# Altium schematic sheet DAP-Power-2.SchDoc
size C; SheetNumber: 2; SheetTotal: 4
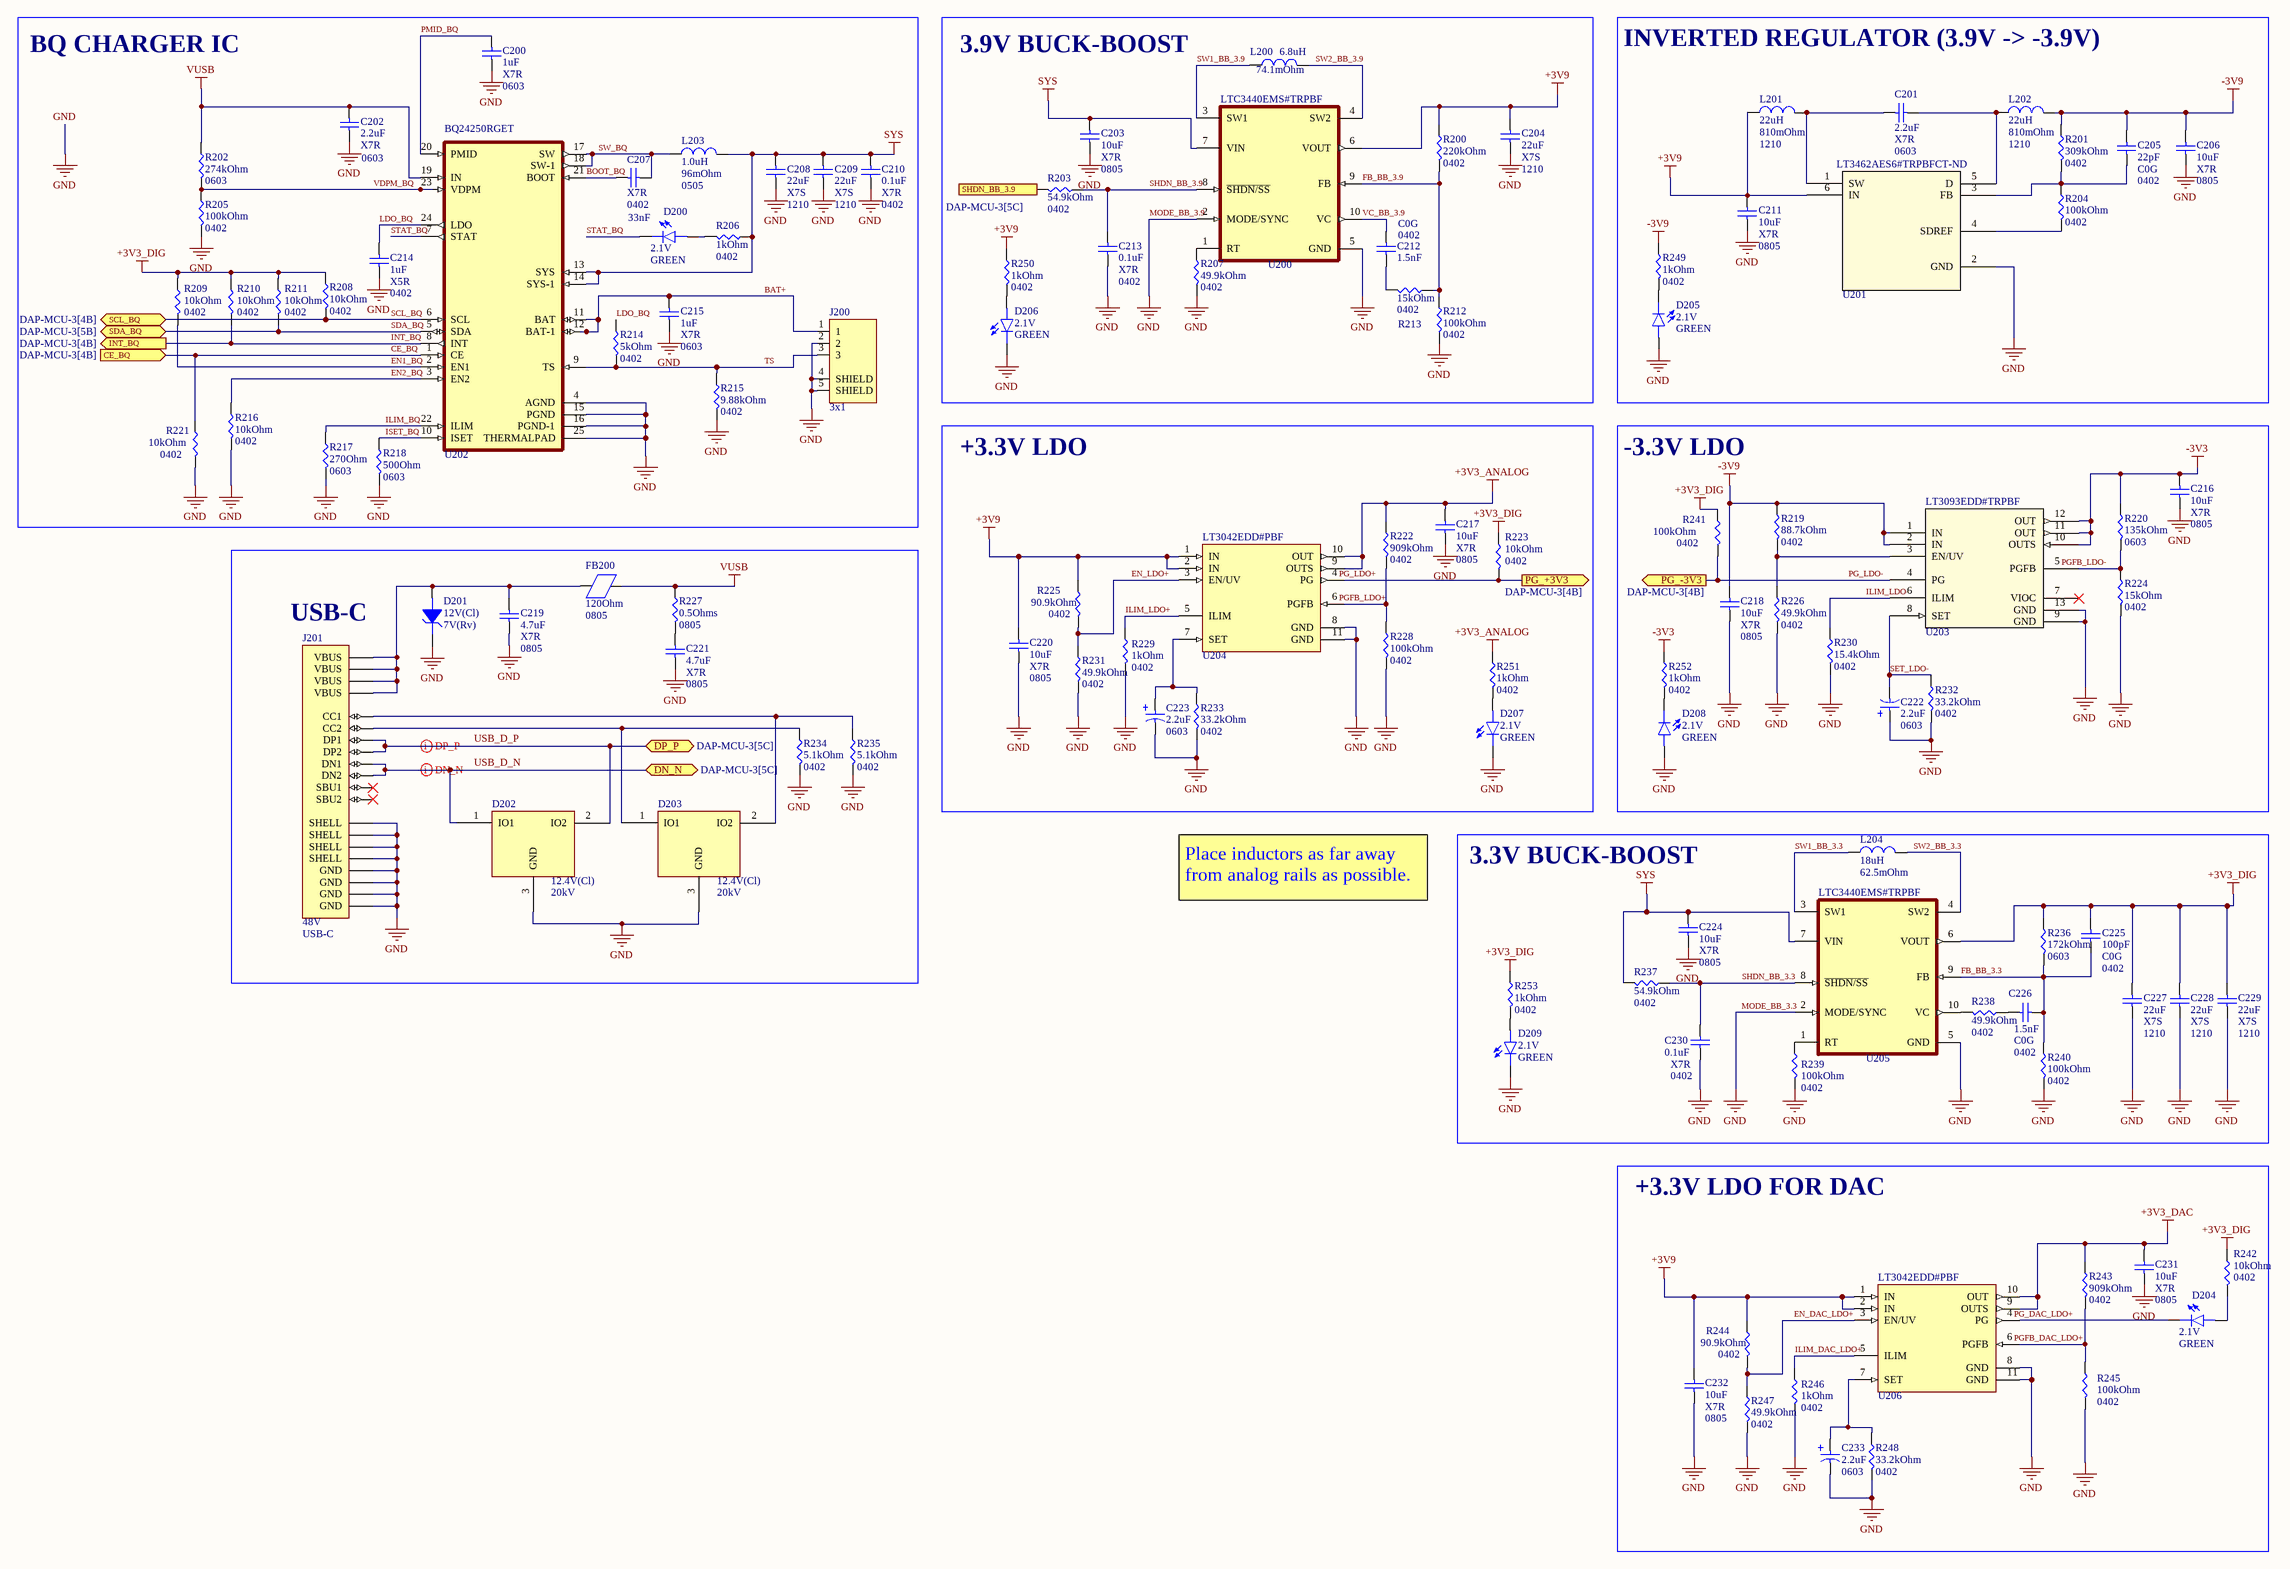
[diagram p0: DAP-Power-2.SchDoc]

## Parts
C200  <Value>: 1uF  <Spec>: X7R  <Footprint>: 0603  [CAPC1608X100N]  (hidden comment: CAP CER 1UF 25V X7R 0603)
C201  <Value>: 2.2uF  <Spec>: X7R  <Footprint>: 0603  [CAPC1608X100N]  (hidden comment: CAP CER 2.2UF 25V X7R 0603)
C202  <Value>: 2.2uF  <Spec>: X7R  <Footprint>: 0603  [CAPC1608X100N]  (hidden comment: CAP CER 2.2UF 25V X7R 0603)
C203  <Value>: 10uF  <Spec>: X7R  <Footprint>: 0805  [CAPC2012X140N]  (hidden comment: CAP CER 10UF 10V X7R 0805)
C204  <Value>: 22uF  <Spec>: X7S  <Footprint>: 1210  [CAPC3225X270N]  (hidden comment: CAP CER 22UF 25V X7S 1210)
C205  <Value>: 22pF  <Spec>: C0G  <Footprint>: 0402  [CAPC1005X60N]  (hidden comment: CAP CER 22PF 50V C0G/NP0 0402)
C206  <Value>: 10uF  <Spec>: X7R  <Footprint>: 0805  [CAPC2012X140N]  (hidden comment: CAP CER 10UF 10V X7R 0805)
C207  <Spec>: X7R  <Footprint>: 0402  <Value>: 33nF  [CAPC1005X60N]  (hidden comment: CAP CER 0.033UF 16V X7R 0402)
C208  <Value>: 22uF  <Spec>: X7S  <Footprint>: 1210  [CAPC3225X270N]  (hidden comment: CAP CER 22UF 25V X7S 1210)
C209  <Value>: 22uF  <Spec>: X7S  <Footprint>: 1210  [CAPC3225X270N]  (hidden comment: CAP CER 22UF 25V X7S 1210)
C210  <Value>: 0.1uF  <Spec>: X7R  <Footprint>: 0402  [CAPC1005X60N]  (hidden comment: CAP CER 0.1UF 50V X7R 0402)
C211  <Value>: 10uF  <Spec>: X7R  <Footprint>: 0805  [CAPC2012X140N]  (hidden comment: CAP CER 10UF 10V X7R 0805)
C212  <Value>: 1.5nF  <Spec>: C0G  <Footprint>: 0402  [CAPC1005X60N]  (hidden comment: CAP CER 1500PF 50V C0G/NP0 0402)
C213  <Value>: 0.1uF  <Spec>: X7R  <Footprint>: 0402  [CAPC1005X60N]  (hidden comment: CAP CER 0.1UF 50V X7R 0402)
C214  <Value>: 1uF  <Spec>: X5R  <Footprint>: 0402  [CAPC1005X60N]  (hidden comment: CAP CER 1UF 35V X5R 0402)
C215  <Value>: 1uF  <Spec>: X7R  <Footprint>: 0603  [CAPC1608X100N]  (hidden comment: CAP CER 1UF 25V X7R 0603)
C216  <Value>: 10uF  <Spec>: X7R  <Footprint>: 0805  [CAPC2012X140N]  (hidden comment: CAP CER 10UF 10V X7R 0805)
C217  <Value>: 10uF  <Spec>: X7R  <Footprint>: 0805  [CAPC2012X140N]  (hidden comment: CAP CER 10UF 10V X7R 0805)
C218  <Value>: 10uF  <Spec>: X7R  <Footprint>: 0805  [CAPC2012X140N]  (hidden comment: CAP CER 10UF 10V X7R 0805)
C219  <Value>: 4.7uF  <Spec>: X7R  <Footprint>: 0805  [CAPC2012X140N]  (hidden comment: CAP CER 4.7UF 16V X7R 0805)
C220  <Value>: 10uF  <Spec>: X7R  <Footprint>: 0805  [CAPC2012X140N]  (hidden comment: CAP CER 10UF 10V X7R 0805)
C221  <Value>: 4.7uF  <Spec>: X7R  <Footprint>: 0805  [CAPC2012X140N]  (hidden comment: CAP CER 4.7UF 16V X7R 0805)
C222  <Value>: 2.2uF  <Footprint>: 0603  [CAP_298D225X0016M2T]  (hidden comment: CAP TANT 2.2UF 20% 16V 0603)
C223  <Value>: 2.2uF  <Footprint>: 0603  [CAP_298D225X0016M2T]  (hidden comment: CAP TANT 2.2UF 20% 16V 0603)
C224  <Value>: 10uF  <Spec>: X7R  <Footprint>: 0805  [CAPC2012X140N]  (hidden comment: CAP CER 10UF 10V X7R 0805)
C225  <Value>: 100pF  <Spec>: C0G  <Footprint>: 0402  [CAPC1005X60N]  (hidden comment: CAP CER 100PF 50V C0G/NP0 0402)
C226  <Value>: 1.5nF  <Spec>: C0G  <Footprint>: 0402  [CAPC1005X60N]  (hidden comment: CAP CER 1500PF 50V C0G/NP0 0402)
C227  <Value>: 22uF  <Spec>: X7S  <Footprint>: 1210  [CAPC3225X270N]  (hidden comment: CAP CER 22UF 25V X7S 1210)
C228  <Value>: 22uF  <Spec>: X7S  <Footprint>: 1210  [CAPC3225X270N]  (hidden comment: CAP CER 22UF 25V X7S 1210)
C229  <Value>: 22uF  <Spec>: X7S  <Footprint>: 1210  [CAPC3225X270N]  (hidden comment: CAP CER 22UF 25V X7S 1210)
C230  <Value>: 0.1uF  <Spec>: X7R  <Footprint>: 0402  [CAPC1005X60N]  (hidden comment: CAP CER 0.1UF 50V X7R 0402)
C231  <Value>: 10uF  <Spec>: X7R  <Footprint>: 0805  [CAPC2012X140N]  (hidden comment: CAP CER 10UF 10V X7R 0805)
C232  <Value>: 10uF  <Spec>: X7R  <Footprint>: 0805  [CAPC2012X140N]  (hidden comment: CAP CER 10UF 10V X7R 0805)
C233  <Value>: 2.2uF  <Footprint>: 0603  [CAP_298D225X0016M2T]  (hidden comment: CAP TANT 2.2UF 20% 16V 0603)
D200  <Value>: 2.1V  <Spec>: GREEN  [LEDM1608X80]  (hidden comment: LED GREEN CLEAR CHIP SMD)
D201  <Value>: 12V(Cl)  <Spec>: 7V(Rv)  [DIOM5226X230N]  (hidden comment: TVS DIODE 7VWM 12VC SMA)
D202  <Value>: 12.4V(Cl)  <Spec>: 20kV  [SOT65P210X110-3N]  (hidden comment: TVS DIODE 5.5VWM 12.4VC SC703)
D203  <Value>: 12.4V(Cl)  <Spec>: 20kV  [SOT65P210X110-3N]  (hidden comment: TVS DIODE 5.5VWM 12.4VC SC703)
D204  <Value>: 2.1V  <Spec>: GREEN  [LEDM1608X80]  (hidden comment: LED GREEN CLEAR CHIP SMD)
D205  <Value>: 2.1V  <Spec>: GREEN  [LEDM1608X80]  (hidden comment: LED GREEN CLEAR CHIP SMD)
D206  <Value>: 2.1V  <Spec>: GREEN  [LEDM1608X80]  (hidden comment: LED GREEN CLEAR CHIP SMD)
D207  <Value>: 2.1V  <Spec>: GREEN  [LEDM1608X80]  (hidden comment: LED GREEN CLEAR CHIP SMD)
D208  <Value>: 2.1V  <Spec>: GREEN  [LEDM1608X80]  (hidden comment: LED GREEN CLEAR CHIP SMD)
D209  <Value>: 2.1V  <Spec>: GREEN  [LEDM1608X80]  (hidden comment: LED GREEN CLEAR CHIP SMD)
FB200  <Value>: 120Ohm  <Footprint>: 0805  [WE-CBF_0805_W4.0]  (hidden comment: FERRITE BEAD 120 OHM 0805 1LN)
J200  <Value>: 3x1  [CONN_505567_03_MOL]  (hidden comment: CONN HEADER SMD R/A 3POS 1.25MM)
J201  <Value>: 48V  <Spec>: USB-C  [GCT_USB4085-GF-A_REVA4]  (hidden comment: CONN RCPT USB2.0 TYPE C 16+8POS)
L200  <Value>: 6.8uH  <Spec>: 74.1mOhm  [IND_SRP4030FA]  (hidden comment: FIXED IND 6.8UH 4A 74.1 MOHM SMD)
L201  <Value>: 22uH  <Spec>: 810mOhm  <Footprint>: 1210  [IND_LQW32FT220M2HL]  (hidden comment: FIXED IND 22UH 300MA 810 MOHM)
L202  <Value>: 22uH  <Spec>: 810mOhm  <Footprint>: 1210  [IND_LQW32FT220M2HL]  (hidden comment: FIXED IND 22UH 300MA 810 MOHM)
L203  <Value>: 1.0uH  <Spec>: 96mOhm  <Footprint>: 0505  [IND_TFM141206BLE]  (hidden comment: FIXED IND 1UH 2A 96 MOHM SMD)
L204  <Value>: 18uH  <Spec>: 62.5mOhm  [IND_XGL5050]  (hidden comment: FIXED IND 18UH 4.5A 62.5 MOHM)
R200  <Value>: 220kOhm  <Footprint>: 0402  [RESC1005X40N]  (hidden comment: RES 220K OHM 0.1% 1/16W 0402)
R201  <Value>: 309kOhm  <Footprint>: 0402  [RESC1005X40N]  (hidden comment: RES SMD 309K OHM 0.1% 1/16W 0402)
R202  <Value>: 274kOhm  <Footprint>: 0603  [0603_Yageo_Res]  (hidden comment: RES SMD 274K OHM 0.5% 1/10W 0603)
R203  <Value>: 54.9kOhm  <Footprint>: 0402  [RESC1005X40N]  (hidden comment: RES SMD 54.9KOHM 0.1% 1/16W 0402)
R204  <Value>: 100kOhm  <Footprint>: 0402  [RESC1005X40N]  (hidden comment: RES SMD 100K OHM 0.1% 1/16W 0402)
R205  <Value>: 100kOhm  <Footprint>: 0402  [RESC1005X40N]  (hidden comment: RES SMD 100K OHM 0.1% 1/16W 0402)
R206  <Value>: 1kOhm  <Footprint>: 0402  [RESC1005X40N]  (hidden comment: RES SMD 1K OHM 0.1% 1/16W 0402)
R207  <Value>: 49.9kOhm  <Footprint>: 0402  [RESC1005X40N]  (hidden comment: RES SMD 49.9KOHM 0.1% 1/16W 0402)
R208  <Value>: 10kOhm  <Footprint>: 0402  [RESC1005X40N]  (hidden comment: RES SMD 10K OHM 1% 1/16W 0402)
R209  <Value>: 10kOhm  <Footprint>: 0402  [RESC1005X40N]  (hidden comment: RES SMD 10K OHM 1% 1/16W 0402)
R210  <Value>: 10kOhm  <Footprint>: 0402  [RESC1005X40N]  (hidden comment: RES SMD 10K OHM 1% 1/16W 0402)
R211  <Value>: 10kOhm  <Footprint>: 0402  [RESC1005X40N]  (hidden comment: RES SMD 10K OHM 1% 1/16W 0402)
R212  <Value>: 100kOhm  <Footprint>: 0402  [RESC1005X40N]  (hidden comment: RES SMD 100K OHM 0.1% 1/16W 0402)
R213  <Value>: 15kOhm  <Footprint>: 0402  [RESC1005X40N]  (hidden comment: RES SMD 15K OHM 0.1% 1/16W 0402)
R214  <Value>: 5kOhm  <Footprint>: 0402  [RESC1005X40N]  (hidden comment: RES 5K OHM 1% 1/16W 0402)
R215  <Value>: 9.88kOhm  <Footprint>: 0402  [RESC1005X40N]  (hidden comment: RES SMD 9.88KOHM 0.5% 1/16W 0402)
R216  <Value>: 10kOhm  <Footprint>: 0402  [RESC1005X40N]  (hidden comment: RES SMD 10K OHM 1% 1/16W 0402)
R217  <Value>: 270Ohm  <Footprint>: 0603  [0603_Yageo_Res]  (hidden comment: RES 270 OHM 1% 1/10W 0603)
R218  <Value>: 500Ohm  <Footprint>: 0603  [0603_Yageo_Res]  (hidden comment: RES 500 OHM 0.1% 1/10W 0603)
R219  <Value>: 88.7kOhm  <Footprint>: 0402  [RESC1005X40N]  (hidden comment: RES 88.7K OHM 1% 1/16W 0402)
R220  <Value>: 135kOhm  <Footprint>: 0603  [RESC1608X55N]  (hidden comment: RES SMD 135K OHM 0.1% 1/10W 0603)
R221  <Value>: 10kOhm  <Footprint>: 0402  [RESC1005X40N]  (hidden comment: RES SMD 10K OHM 1% 1/16W 0402)
R222  <Value>: 909kOhm  <Footprint>: 0402  [RESC1005X40N]  (hidden comment: RES 909K OHM 1% 1/16W 0402)
R223  <Value>: 10kOhm  <Footprint>: 0402  [RESC1005X40N]  (hidden comment: RES SMD 10K OHM 1% 1/16W 0402)
R224  <Value>: 15kOhm  <Footprint>: 0402  [RESC1005X40N]  (hidden comment: RES SMD 15K OHM 0.1% 1/16W 0402)
R225  <Value>: 90.9kOhm  <Footprint>: 0402  [RESC1005X40N]  (hidden comment: RES SMD 90.9KOHM 0.1% 1/16W 0402)
R226  <Value>: 49.9kOhm  <Footprint>: 0402  [RESC1005X40N]  (hidden comment: RES SMD 49.9KOHM 0.1% 1/16W 0402)
R227  <Value>: 0.5Ohms  <Footprint>: 0805  [RES-PYU-PE]  (hidden comment: RES 0.5 OHM 1% 1/4W 0805)
R228  <Value>: 100kOhm  <Footprint>: 0402  [RESC1005X40N]  (hidden comment: RES SMD 100K OHM 0.1% 1/16W 0402)
R229  <Value>: 1kOhm  <Footprint>: 0402  [RESC1005X40N]  (hidden comment: RES SMD 1K OHM 0.1% 1/16W 0402)
R230  <Value>: 15.4kOhm  <Footprint>: 0402  [RESC1005X40N]  (hidden comment: RES SMD 15.4KOHM 0.1% 1/16W 0402)
R231  <Value>: 49.9kOhm  <Footprint>: 0402  [RESC1005X40N]  (hidden comment: RES SMD 49.9KOHM 0.1% 1/16W 0402)
R232  <Value>: 33.2kOhm  <Footprint>: 0402  [RESC1005X40N]  (hidden comment: RES SMD 33.2KOHM 0.1% 1/16W 0402)
R233  <Value>: 33.2kOhm  <Footprint>: 0402  [RESC1005X40N]  (hidden comment: RES SMD 33.2KOHM 0.1% 1/16W 0402)
R234  <Value>: 5.1kOhm  <Footprint>: 0402  [RESC1005X35N]  (hidden comment: RES SMD 5.1K OHM 0.1% 1/16W 0402)
R235  <Value>: 5.1kOhm  <Footprint>: 0402  [RESC1005X35N]  (hidden comment: RES SMD 5.1K OHM 0.1% 1/16W 0402)
R236  <Value>: 172kOhm  <Footprint>: 0603  [RESC1608X55N]  (hidden comment: RES 172K OHM 0.1% 1/10W 0603)
R237  <Value>: 54.9kOhm  <Footprint>: 0402  [RESC1005X40N]  (hidden comment: RES SMD 54.9KOHM 0.1% 1/16W 0402)
R238  <Value>: 49.9kOhm  <Footprint>: 0402  [RESC1005X40N]  (hidden comment: RES SMD 49.9KOHM 0.1% 1/16W 0402)
R239  <Value>: 100kOhm  <Footprint>: 0402  [RESC1005X40N]  (hidden comment: RES SMD 100K OHM 0.1% 1/16W 0402)
R240  <Value>: 100kOhm  <Footprint>: 0402  [RESC1005X40N]  (hidden comment: RES SMD 100K OHM 0.1% 1/16W 0402)
R241  <Value>: 100kOhm  <Footprint>: 0402  [RESC1005X40N]  (hidden comment: RES SMD 100K OHM 0.1% 1/16W 0402)
R242  <Value>: 10kOhm  <Footprint>: 0402  [RESC1005X40N]  (hidden comment: RES SMD 10K OHM 1% 1/16W 0402)
R243  <Value>: 909kOhm  <Footprint>: 0402  [RESC1005X40N]  (hidden comment: RES 909K OHM 1% 1/16W 0402)
R244  <Value>: 90.9kOhm  <Footprint>: 0402  [RESC1005X40N]  (hidden comment: RES SMD 90.9KOHM 0.1% 1/16W 0402)
R245  <Value>: 100kOhm  <Footprint>: 0402  [RESC1005X40N]  (hidden comment: RES SMD 100K OHM 0.1% 1/16W 0402)
R246  <Value>: 1kOhm  <Footprint>: 0402  [RESC1005X40N]  (hidden comment: RES SMD 1K OHM 0.1% 1/16W 0402)
R247  <Value>: 49.9kOhm  <Footprint>: 0402  [RESC1005X40N]  (hidden comment: RES SMD 49.9KOHM 0.1% 1/16W 0402)
R248  <Value>: 33.2kOhm  <Footprint>: 0402  [RESC1005X40N]  (hidden comment: RES SMD 33.2KOHM 0.1% 1/16W 0402)
R249  <Value>: 1kOhm  <Footprint>: 0402  [RESC1005X40N]  (hidden comment: RES SMD 1K OHM 0.1% 1/16W 0402)
R250  <Value>: 1kOhm  <Footprint>: 0402  [RESC1005X40N]  (hidden comment: RES SMD 1K OHM 0.1% 1/16W 0402)
R251  <Value>: 1kOhm  <Footprint>: 0402  [RESC1005X40N]  (hidden comment: RES SMD 1K OHM 0.1% 1/16W 0402)
R252  <Value>: 1kOhm  <Footprint>: 0402  [RESC1005X40N]  (hidden comment: RES SMD 1K OHM 0.1% 1/16W 0402)
R253  <Value>: 1kOhm  <Footprint>: 0402  [RESC1005X40N]  (hidden comment: RES SMD 1K OHM 0.1% 1/16W 0402)
U200  IC REG BUCK BST ADJ 600MA 10MSOP  [SOP50P490X110-10N]  (value not drawn)
U201  Supplier Part Number 1: LT3462AES6#TRPBFCT-ND  [TSOT-23_S6]  (hidden comment: IC REG CUK ADJ 250MA TSOT23-6)
U202  IC BATT CHG LI-ION 1CELL 24VQFN  [QFN50P400X400X100-25N]  (value not drawn)
U203  Manufacturer Part Number 1: LT3093EDD#TRPBF  [05-08-1725_ADI]  (hidden comment: IC REG LIN NEG ADJ 200MA 12-DFN)
U204  IC REG LIN POS ADJ 200MA 10DFN  [VREG_LT3042EDD#PBF]  (value not drawn)
U205  IC REG BUCK BST ADJ 600MA 10MSOP  [SOP50P490X110-10N]  (value not drawn)
U206  IC REG LIN POS ADJ 200MA 10DFN  [VREG_LT3042EDD#PBF]  (value not drawn)

## Blocks framed on the sheet
BQ CHARGER IC: C200 C202 C207-C210 C214 C215 D200 J200 L203 R202 R205 R206 R208-R211 R214-R218 R221 U202
3.9V BUCK-BOOST: C203 C204 C212 C213 D206 L200 R200 R203 R207 R212 R213 R250 U200
INVERTED REGULATOR (3.9V -> -3.9V): C201 C205 C206 C211 D205 L201 L202 R201 R204 R249 U201
+3.3V LDO: C217 C220 C223 D207 R222 R223 R225 R228 R229 R231 R233 R251 U204
-3.3V LDO: C216 C218 C222 D208 R219 R220 R224 R226 R230 R232 R241 R252 U203
USB-C: C219 C221 D201-D203 FB200 J201 R227 R234 R235
3.3V BUCK-BOOST: C224-C230 D209 L204 R236-R240 R253 U205
+3.3V LDO FOR DAC: C231-C233 D204 R242-R248 U206

## Ports
CE_BQ (in, see DAP-MCU-3[4B]), DN_N (bidir, see DAP-MCU-3[5C]), DP_P (bidir, see DAP-MCU-3[5C]), INT_BQ (out, see DAP-MCU-3[4B]), PG_+3V3 (out, see DAP-MCU-3[4B]), PG_-3V3 (out, see DAP-MCU-3[4B]), SCL_BQ (bidir, see DAP-MCU-3[4B]), SDA_BQ (bidir, see DAP-MCU-3[5B]), SHDN_BB_3.9 (in, see DAP-MCU-3[5C])

## Nets
+3V3_ANALOG: C217.2 R222.2 R251.2 U204.9(OUTS) U204.10(OUT)
+3V3_DAC: C231.2 R243.2 U206.9(OUTS) U206.10(OUT)
+3V3_DIG: C225.2 C227.2 C228.2 C229.2 R208.2 R209.2 R210.2 R211.2 R223.2 R236.2 R241.2 R242.2 R253.2 U205.6(VOUT)
+3V9: C204.2 C211.2 C220.2 C232.2 L201.1 R200.2 R225.2 R244.2 R250.2 U200.6(VOUT) U201.6(IN) U204.1(IN) U204.2(IN) U206.1(IN) U206.2(IN)
-3V3: C216.2 R220.2 R252.2 U203.10(OUTS) U203.11(OUT) U203.12(OUT)
-3V9: C205.2 C206.2 C218.2 L202.2 R201.2 R219.2 R249.2 U203.1(IN) U203.2(IN)
GND: C200.1 C202.1 C203.1 C204.1 C206.1 C208.1 C209.1 C210.1 C211.1 C213.1 C214.1 C215.1 C216.1 C217.1 C218.1 C219.1 C220.1 C221.1 C222.1 C223.2 C224.1 C227.1 C228.1 C229.1 C230.1 C231.1 C232.1 C233.2 D201.C D202.3(GND) D203.3(GND) D205.A D206.C D207.C D208.A D209.C J200.2 J200.4(SHIELD) J200.5(SHIELD) J201.A1(GND) J201.A12(GND) J201.B1(GND) J201.B12(GND) J201.S1(SHELL) J201.S2(SHELL) J201.S3(SHELL) J201.S4(SHELL) R205.1 R207.1 R212.1 R215.1 R216.1 R217.1 R218.1 R221.1 R224.1 R226.1 R228.1 R229.1 R230.1 R231.1 R232.1 R233.1 R234.1 R235.1 R239.1 R240.1 R245.1 R246.1 R247.1 R248.1 U200.2(MODE/SYNC) U200.5(GND) U201.2(GND) U202.4(AGND) U202.15(PGND) U202.16(PGND-1) U202.25(THERMALPAD) U203.9(GND) U203.13(GND) U204.8(GND) U204.11(GND) U205.2(MODE/SYNC) U205.5(GND) U206.8(GND) U206.11(GND)  [also labelled MODE_BB_3.3, MODE_BB_3.9]
SYS: C203.2 C208.2 C209.2 C210.2 C224.2 L203.2 R206.2 R237.1 U200.7(VIN) U202.13(SYS) U202.14(SYS-1) U205.7(VIN)
VUSB: C202.2 FB200.2 R202.2 R227.2 U202.19(IN)
BAT+: C215.2 J200.1 U202.11(BAT) U202.12(BAT-1)
BOOT_BQ: C207.2 U202.21(BOOT)
CE_BQ: R221.2 U202.1(CE) ; port CE_BQ
EN1_BQ: R209.1 U202.2(EN1)
EN2_BQ: R216.2 U202.3(EN2)
EN_DAC_LDO+: R244.1 R247.2 U206.3(EN/UV)
EN_LDO+: R225.1 R231.2 U204.3(EN/UV)
FB_BB_3.3: C225.1 C226.1 R236.1 R240.2 U205.9(FB)
FB_BB_3.9: R200.1 R212.2 R213.2 U200.9(FB)
ILIM_BQ: R217.2 U202.22(ILIM)
ILIM_DAC_LDO+: R246.2 U206.5(ILIM)
ILIM_LDO+: R229.2 U204.5(ILIM)
ILIM_LDO-: R230.2 U203.6(ILIM)
INT_BQ: R210.1 U202.8(INT) ; port INT_BQ
ISET_BQ: R218.2 U202.10(ISET)
LDO_BQ: C214.2 R214.2 U202.24(LDO)
PG_+3V3: R223.1 U204.4(PG) ; port PG_+3V3
PG_LDO-: R241.1 U203.4(PG) ; port PG_-3V3
PMID_BQ: C200.2 U202.20(PMID)
SCL_BQ: R208.1 U202.6(SCL) ; port SCL_BQ
SDA_BQ: R211.1 U202.5(SDA) ; port SDA_BQ
SET_LDO-: C222.2 R232.2 U203.8(SET)
SHDN_BB_3.3: C230.2 R237.2 U205.8(~{SHDN/SS})
SHDN_BB_3.9: C213.2 R203.2 U200.8(~{SHDN/SS})
SHDN_BB_3.9: R203.1 ; port SHDN_BB_3.9  [a separate net that carries the same name]
STAT_BQ: D200.C U202.7(STAT)
SW1_BB_3.3: L204.1 U205.3(SW1)
SW1_BB_3.9: L200.1 U200.3(SW1)
SW2_BB_3.3: L204.2 U205.4(SW2)
SW2_BB_3.9: L200.2 U200.4(SW2)
SW_BQ: C207.1 L203.1 U202.17(SW) U202.18(SW-1)
TS: J200.3 R214.1 R215.2 U202.9(TS)
USB_D_N: D202.1(IO1) J201.A7(DN1) J201.B7(DN2) ; port DN_N
USB_D_P: D202.2(IO2) J201.A6(DP1) J201.B6(DP2) ; port DP_P
VC_BB_3.9: C212.2 U200.10(VC)
VDPM_BQ: R202.1 R205.2 U202.23(VDPM)
NetC201_1: C201.1 L202.1 U201.5(D)
NetC201_2: C201.2 L201.2 U201.1(SW)
NetC205_1: C205.1 R201.1 R204.2 U201.3(FB)
NetC212_1: C212.1 R213.1
NetC219_2: C219.2 D201.A FB200.1 J201.A4(VBUS) J201.A9(VBUS) J201.B4(VBUS) J201.B9(VBUS)
NetC221_2: C221.2 R227.1
NetC223_1: C223.1 R233.2 U204.7(SET)
NetC226_2: C226.2 R238.2
NetC233_1: C233.1 R248.2 U206.7(SET)
NetD200_A: D200.A R206.1
NetD203_1: D203.1(IO1) J201.B5(CC2) R234.2
NetD203_2: D203.2(IO2) J201.A5(CC1) R235.2
NetD204_A: D204.A R242.1
NetD204_C: D204.C U206.4(PG)
NetD205_C: D205.C R249.1
NetD206_A: D206.A R250.1
NetD207_A: D207.A R251.1
NetD208_C: D208.C R252.1
NetD209_A: D209.A R253.1
NetR204_1: R204.1 U201.4(SDREF)
NetR207_2: R207.2 U200.1(RT)
NetR219_1: R219.1 R226.2 U203.3(EN/UV)
NetR220_1: R220.1 R224.2 U203.5(PGFB)
NetR222_1: R222.1 R228.2 U204.6(PGFB)
NetR238_1: R238.1 U205.10(VC)
NetR239_2: R239.2 U205.1(RT)
NetR243_1: R243.1 R245.2 U206.6(PGFB)

Not connected (* = marked no-connect by the designer): J201 A8(SBU1)* B8(SBU2)*; U203 7(VIOC)*

## Layout directives
differential pair: USB_D_N, USB_D_P

## Notes on the sheet
- Place inductors as far away from analog rails as possible.
- Labels drawn without touching a wire or pin: PG_DAC_LDO+, PG_LDO+, PGFB_DAC_LDO+, PGFB_LDO+, PGFB_LDO-

## Library data of the parts
C200 C215 = #1-132: Manufacturer 1: Murata Electronics; Manufacturer Part Number 1: GCM188R71E105KA64D; AL-PN: #1-132; SubType: Ceramic; <Tolerance>: 0.1; <Termination>: SMD; Creator Project: DAP; Type: Standard; Lead Time: 21 Weeks; PartType: Capacitor; <Rating>: 25V; Status: Verified; Supplier 1: Digikey; Supplier Label: 1 µF ±10% 25V Ceramic Capacitor X7R 0603 (1608 Metric); Supplier Part Number 1: 490-10673-1-ND
C201 C202 = #1-070: Manufacturer 1: Murata Electronics; Manufacturer Part Number 1: GRM188Z71E225KE43D; AL-PN: #1-070; SubType: Ceramic; <Tolerance>: 0.1; <Termination>: SMD; Creator Project: DAP; Type: Standard; Lead Time: 17 Weeks; PartType: Capacitor; <Rating>: 25V; Status: Verified; Supplier 1: Digikey; Supplier Label: 2.2 µF ±10% 25V Ceramic Capacitor X7R 0603 (1608 Metric); Supplier Part Number 1: 490-GRM188Z71E225KE43DCT-ND
C203 C206 C211 C216-C218 C220 C224 C231 C232 = #1-081: Manufacturer 1: Murata Electronics; Manufacturer Part Number 1: GCM21BR71A106KE22K; AL-PN: #1-081; SubType: Ceramic; <Tolerance>: 0.1; <Termination>: SMD; Creator Project: DAP; Type: Standard; Lead Time: 21 Weeks; PartType: Capacitor; <Rating>: 10V; Status: Verified; Supplier 1: Digikey; Supplier Label: 10 µF ±10% 10V Ceramic Capacitor X7R 0805 (2012 Metric); Supplier Part Number 1: 490-14531-1-ND
C204 C208 C209 C227-C229 = #1-073: Manufacturer 1: Murata Electronics; Manufacturer Part Number 1: GCM32EC71E226KE36L; AL-PN: #1-073; SubType: Ceramic; <Tolerance>: 0.1; <Termination>: SMD; Creator Project: DAP; Type: Standard; Lead Time: 21 Weeks; PartType: Capacitor; <Rating>: 25V; Status: Verified; Supplier 1: Digikey; Supplier Label: 22 µF ±10% 25V Ceramic Capacitor X7S 1210 (3225 Metric); Supplier Part Number 1: 490-GCM32EC71E226KE36LCT-ND
C205 = #1-093: Manufacturer 1: Murata Electronics; Manufacturer Part Number 1: GRM1555C1H220JA01D; AL-PN: #1-093; SubType: Ceramic; <Tolerance>: 0.05; <Termination>: SMD; Creator Project: DAP; Type: Standard; Lead Time: 17 Weeks; PartType: Capacitor; <Rating>: 50V; Status: Verified; Supplier 1: Digikey; Supplier Label: 22 pF ±5% 50V Ceramic Capacitor C0G, NP0 0402 (1005 Metric); Supplier Part Number 1: 490-5868-1-ND
C207 = #1-059: Manufacturer 1: Murata Electronics; Manufacturer Part Number 1: GRM155R71C333KA01D; AL-PN: #1-059; SubType: Ceramic; <Tolerance>: 0.1; <Termination>: SMD; Creator Project: DAP; Type: Standard; Lead Time: 17 Weeks; PartType: Capacitor; <Rating>: 16V; Status: Verified; Supplier 1: Digikey; Supplier Label: 0.033 µF ±10% 16V Ceramic Capacitor X7R 0402 (1005 Metric); Supplier Part Number 1: 490-3257-1-ND
C210 = #1-048: Manufacturer 1: Murata Electronics; Manufacturer Part Number 1: GRM155R71H104KE14D; AL-PN: #1-048; SubType: Ceramic; <Tolerance>: 0.1; <Termination>: SMD; Creator Project: aRTy; Type: Standard; Lead Time: 17 Weeks; PartType: Capacitor; <Rating>: 50V; Status: Verified; Supplier 1: Digikey; Supplier Label: 0.1 µF ±10% 50V Ceramic Capacitor X7R 0402 (1005 Metric); Supplier Part Number 1: 490-10700-1-ND
C212 C226 = #1-077: Manufacturer 1: Murata Electronics; Manufacturer Part Number 1: GRM1555C1H152GA01D; AL-PN: #1-077; SubType: Ceramic; <Tolerance>: 0.02; <Termination>: SMD; Creator Project: DAP; Type: Standard; Lead Time: 17 Weeks; PartType: Capacitor; <Rating>: 50V; Status: Verified; Supplier 1: Digikey; Supplier Label: 1500 pF ±2% 50V Ceramic Capacitor C0G, NP0 0402 (1005 Metric); Supplier Part Number 1: 490-GRM1555C1H152GA01DCT-ND
C213 C230 = #1-080: Manufacturer 1: Murata Electronics; Manufacturer Part Number 1: GCM155R71H104KE02D; AL-PN: #1-080; SubType: Ceramic; <Tolerance>: 0.1; <Termination>: SMD; Creator Project: DAP; Type: Standard; Lead Time: 21 Weeks; PartType: Capacitor; <Rating>: 50V; Status: Verified; Supplier 1: Digikey; Supplier Label: 0.1 µF ±10% 50V Ceramic Capacitor X7R 0402 (1005 Metric); Supplier Part Number 1: 490-10672-1-ND
C214 = #1-092: Manufacturer 1: Murata Electronics; Manufacturer Part Number 1: GRM155R6YA105KE11D; AL-PN: #1-092; SubType: Ceramic; <Tolerance>: 0.1; <Termination>: SMD; Creator Project: DAP; Type: Standard; Lead Time: 17 Weeks; PartType: Capacitor; <Rating>: 35V; Status: Verified; Supplier 1: Digikey; Supplier Label: 1 µF ±10% 35V Ceramic Capacitor X5R 0402 (1005 Metric); Supplier Part Number 1: 490-10019-1-ND
C219 C221 = #1-071: Manufacturer 1: Murata Electronics; Manufacturer Part Number 1: GRM21BR71C475KE51L; AL-PN: #1-071; SubType: Ceramic; <Tolerance>: 0.1; <Termination>: SMD; Creator Project: DAP; Type: Standard; Lead Time: 17 Weeks; PartType: Capacitor; <Rating>: 16V; Status: Verified; Supplier 1: Digikey; Supplier Label: 4.7 µF ±10% 16V Ceramic Capacitor X7R 0805 (2012 Metric); Supplier Part Number 1: 490-14466-1-ND
C222 C223 C233 = #1-098: Manufacturer 1: Vishay Sprague; Manufacturer Part Number 1: 298D225X0016M2T; AL-PN: #1-098; SubType: Tantalum; <Tolerance>: 0.2; <Termination>: SMD; Creator Project: DAP; Type: Standard; Lead Time: 23 Weeks; PartType: Capacitor; <Rating>: 16V; Status: Verified; Supplier 1: Digikey; Supplier Label: 2.2 µF Molded Tantalum Capacitors 16 V 0603 (1608 Metric) 12Ohm; Supplier Part Number 1: 718-1613-1-ND
C225 = #1-096: Manufacturer 1: Murata Electronics; Manufacturer Part Number 1: GRM1555C1H101JA01D; AL-PN: #1-096; SubType: Ceramic; <Tolerance>: 0.05; <Termination>: SMD; Creator Project: DAP; Type: Standard; Lead Time: 17 Weeks; PartType: Capacitor; <Rating>: 50V; Status: Verified; Supplier 1: Digikey; Supplier Label: 100 pF ±5% 50V Ceramic Capacitor C0G, NP0 0402 (1005 Metric); Supplier Part Number 1: 490-5922-1-ND
D200 D204-D209 = #1-009: Manufacturer 1: Lite-On Inc; Manufacturer Part Number 1: LTST-C190GKT; AL-PN: #1-009; <Rating>: 30mA; Creator Project: Bootcamp; Type: Standard; Lead Time: 14 Weeks; PartType: Diode; SubType: LED; <Termination>: SMD; Status: Verified; Supplier 1: Digikey; Supplier Label: Green 569nm LED Indication - Discrete 2.1V 0603 (1608 Metric); Supplier Part Number 1: 160-LTST-C190GKTTR-ND
D201 = #1-049: Manufacturer 1: Diodes Incorporated; Manufacturer Part Number 1: SMAJ7.0A-13-F; AL-PN: #1-049; <Rating>: 7.78V(Bd); <Termination>: SMD; Creator Project: aRTy; Type: Standard; Lead Time: 12 Weeks; PartType: Diode; SubType: TVS; Status: Verified; Supplier 1: Digikey; Supplier Label: 12V Clamp 33.3A Ipp Tvs Diode Surface Mount SMA; Supplier Part Number 1: SMAJ7.0A-FDICT-ND
D202 D203 = #1-099: Manufacturer 1: Texas Instruments; Manufacturer Part Number 1: TPD2E2U06QDCKRQ1; AL-PN: #1-099; <Rating>: 1.5pF; <Termination>: SMD; Creator Project: DAP; Type: Standard; Lead Time: 9 Weeks; PartType: Diode; SubType: TVS; Status: Verified; Supplier 1: Digikey; Supplier Label: 12.4V (Typ) Clamp 5.5A (8/20µs) Ipp Tvs Diode Surface Mount SC-70-3; Supplier Part Number 1: 296-44302-1-ND
FB200 = #1-068: Manufacturer 1: Würth Elektronik; Manufacturer Part Number 1: 742792023; AL-PN: #1-068; <Rating>: 3A; <Termination>: SMD; Creator Project: DAP; Type: Standard; Lead Time: 33 Weeks; PartType: Misc; SubType: Ferrite Bead; Status: Verified; Supplier 1: Digikey; Supplier Label: 120 Ohms @ 100 MHz 1 Signal Line Ferrite Bead 0805 (2012 Metric) 3A 30mOhm; Supplier Part Number 1: 732-1613-1-ND
J200 = #1-137: Manufacturer 1: Molex; Manufacturer Part Number 1: 5055670381; MF: {'manufacturer': u'Molex'}; MP: 436500329; AL-PN: #1-137; Creator Project: DAP; Lead Time: 19 Weeks; Package: None; Price: None; Value: *; Availability: Unavailable; PartType: Connector; SubType: Header; <Termination>: SMD; Status: Verified; Supplier 1: Digikey; Supplier Label: Connector Header Surface Mount, Right Angle 3 position 0.049" (1.25mm); Supplier Part Number 1: WM22227CT-ND; Type: Standard
J201 = #1-069: Manufacturer 1: GCT; MP: USB4085-GF-A; MF: Global Connector Technology; AL-PN: #1-069; SubType: USB; <Rating>: 5A; <Termination>: Thru; Creator Project: DAP; Lead Time: 7 Weeks; SnapEDA_Link: https://www.snapeda.com/parts/USB4085-GF-A/Global+Connector+Technology/view-part/?ref=snap; Package: None; Check_prices: https://www.snapeda.com/parts/USB4085-GF-A/Global+Connector+Technology/view-part/?ref=eda; Purchase-URL: https://pricing.snapeda.com/search/part/USB4085-GF-A/?ref=eda; Price: None; Value: *; Availability: In Stock; PartType: Connector; Status: Verified; Supplier 1: Digikey; Supplier Label: USB-C (USB TYPE-C) USB 2.0 Receptacle Connector 24 (16+8 Dummy) Position Through Hole, Right Angle; Supplier Part Number 1: 2073-USB4085-GF-ACT-ND; Type: Standard; Manufacturer Part Number 1: USB4085-GF-A
L200 = #1-076: Manufacturer 1: Bourns Inc.; Manufacturer Part Number 1: SRP4030FA-6R8M; AL-PN: #1-076; SubType: Shielded; <Rating>: 3.5A; <Tolerance>: 0.2; Creator Project: DAP; Type: Standard; Lead Time: 22 Weeks; PartType: Inductor; <Termination>: SMD; Status: Verified; Supplier 1: Digikey; Supplier Label: 6.8 µH Shielded Drum Core, Wirewound Inductor 4 A 74.1mOhm Max Nonstandard; Supplier Part Number 1: SRP4030FA-6R8MCT-ND
L201 L202 = #1-090: Manufacturer 1: Murata Electronics; Manufacturer Part Number 1: 490-LQW32FT220M2HLTR; AL-PN: #1-090; SubType: Shielded; <Rating>: 400mA; <Tolerance>: 0.2; <Termination>: SMD; Creator Project: DAP; Type: Standard; Lead Time: 25 Weeks; PartType: Inductor; Status: Verified; Supplier 1: Digikey; Supplier Label: 22 µH Shielded Wirewound Inductor 300 mA 810mOhm Max 1210 (3225 Metric); Supplier Part Number 1: 490-LQW32FT220M2HLCT-ND
L203 = #1-063: Manufacturer 1: TDK; Manufacturer Part Number 1: TFM141206BLE-1R0MTCA; AL-PN: #1-063; SubType: Shielded; <Tolerance>: 0.2; Creator Project: DAP; Type: Standard; Lead Time: 20 Weeks; PartType: Inductor; <Rating>: 2A; <Termination>: SMD; Status: Verified; Supplier 1: Digikey; Supplier Label: 1 µH Shielded Thin Film Inductor 2 A 96mOhm Max 0505 (1412 Metric); Supplier Part Number 1: 445-TFM141206BLE-1R0MTCACT-ND
L204 = #1-094: Manufacturer 1: Coilcraft; Manufacturer Part Number 1: XGL5050-183MEC; AL-PN: #1-094; SubType: Shielded; <Rating>: 3.7A; <Tolerance>: 0.2; <Termination>: SMD; Creator Project: DAP; Type: Standard; PartType: Inductor; Status: Verified; Supplier 1: Digikey; Supplier Label: 18 µH Shielded Molded Inductor 4.5 A 62.5mOhm Max Nonstandard; Supplier Part Number 1: 2457-XGL5050-183MEC-ND; Lead Time: N/A
R200 = #1-074: Manufacturer 1: YAGEO; Manufacturer Part Number 1: RC0402BR-07220KL; AL-PN: #1-074; <Tolerance>: 0.001; <Termination>: SMD; Creator Project: DAP; Lead Time: 17 Weeks; PartType: Resistor; <Rating>: 1/16W; Status: Verified; Supplier 1: Digikey; Supplier Label: 220 kOhms ±0.1% 0.063W, 1/16W Chip Resistor 0402 (1005 Metric) Moisture Resistant Thick Film; Supplier Part Number 1: 13-RC0402BR-07220KLCT-ND; Type: Standard
R201 = #1-091: Manufacturer 1: YAGEO; Manufacturer Part Number 1: RE0402BRE07309KL; AL-PN: #1-091; <Tolerance>: 0.001; Creator Project: DAP; Lead Time: 20 Weeks; PartType: Resistor; <Rating>: 1/16W; <Termination>: SMD; Status: Verified; Supplier 1: Digikey; Supplier Label: 309 kOhms ±0.1% 0.063W, 1/16W Chip Resistor 0402 (1005 Metric) Thick Film; Supplier Part Number 1: 13-RE0402BRE07309KLCT-ND; Type: Standard
R202 = #1-067: Manufacturer 1: YAGEO; Manufacturer Part Number 1: RT0603DRE07274KL; AL-PN: #1-067; <Rating>: 0.1W; <Tolerance>: 0.005; Creator Project: DAP; Lead Time: 20 Weeks; PartType: Resistor; <Termination>: SMD; Status: Verified; Supplier 1: Digikey; Supplier Label: RES SMD 274K OHM 0.5% 1/10W 0603; Supplier Part Number 1: 13-RT0603DRE07274KLCT-ND; Type: Standard
R203 R237 = #1-079: Manufacturer 1: YAGEO; Manufacturer Part Number 1: RT0402BRD0754K9L; AL-PN: #1-079; <Tolerance>: 0.001; Creator Project: DAP; Lead Time: 20 Weeks; PartType: Resistor; <Rating>: 1/16W; <Termination>: SMD; Status: Verified; Supplier 1: Digikey; Supplier Label: 54.9 kOhms ±0.1% 0.063W, 1/16W Chip Resistor 0402 (1005 Metric) Thin Film; Supplier Part Number 1: YAG1452CT-ND; Type: Standard
R204 R205 R212 R228 R239-R241 R245 = #1-131: Manufacturer 1: YAGEO; Manufacturer Part Number 1: RT0402BRD07100KL; AL-PN: #1-131; <Tolerance>: 0.01; Creator Project: DAP; Lead Time: 23 Weeks; PartType: Resistor; <Termination>: SMD; Status: Verified; Supplier 1: Digikey; Supplier Label: 100 kOhms ±0.1% 0.063W, 1/16W Chip Resistor 0402 (1005 Metric) Thin Film; Supplier Part Number 1: YAG1343CT-ND; Type: Standard
R206 R229 R246 R249-R253 = #1-043: Manufacturer 1: YAGEO; Manufacturer Part Number 1: RT0402BRD071KL; AL-PN: #1-043; <Tolerance>: 0.001; Creator Project: aRTy; Lead Time: 20 Weeks; PartType: Resistor; <Rating>: 1/16W; <Termination>: SMD; Status: Verified; Supplier 1: Digikey; Supplier Label: 1 kOhms ±0.1% 0.063W, 1/16W Chip Resistor 0402 (1005 Metric) Thin Film; Supplier Part Number 1: YAG1386TR-ND; Type: Standard
R207 R226 R231 R238 R247 = #1-138: Manufacturer 1: YAGEO; Manufacturer Part Number 1: RT0402BRD0749K9L; AL-PN: #1-138; <Tolerance>: 0.001; Creator Project: DAP; Lead Time: 23 Weeks; PartType: Resistor; <Termination>: SMD; Status: Verified; Supplier 1: Digikey; Supplier Label: 49.9 kOhms ±0.1% 0.063W, 1/16W Chip Resistor 0402 (1005 Metric) Thin Film; Supplier Part Number 1: YAG4270CT-ND; Type: Standard
R208-R211 R216 R221 R223 R242 = #1-134: Manufacturer 1: YAGEO; Manufacturer Part Number 1: AC0402FR-0710KL; AL-PN: #1-134; <Tolerance>: 0.01; Creator Project: DAP; Lead Time: 22 Weeks; PartType: Resistor; <Termination>: SMD; Status: Verified; Supplier 1: Digikey; Supplier Label: 10 kOhms ±1% 0.063W, 1/16W Chip Resistor 0402 (1005 Metric) Automotive AEC-Q200, Moisture Resistant Thick Film; Supplier Part Number 1: YAG3436CT-ND; Type: Standard
R213 R224 = #1-078: Manufacturer 1: YAGEO; Manufacturer Part Number 1: RT0402BRD0715KL; AL-PN: #1-078; <Tolerance>: 0.001; Creator Project: DAP; Lead Time: 20 Weeks; PartType: Resistor; <Rating>: 1/16W; <Termination>: SMD; Status: Verified; Supplier 1: Digikey; Supplier Label: 15 kOhms ±0.1% 0.063W, 1/16W Chip Resistor 0402 (1005 Metric) Thin Film; Supplier Part Number 1: YAG2302CT-ND; Type: Standard
R214 = #1-060: Manufacturer 1: YAGEO; Manufacturer Part Number 1: RC0402FR-075KL; AL-PN: #1-060; <Tolerance>: 0.01; <Termination>: SMD; Creator Project: DAP; Lead Time: 17 Weeks; PartType: Resistor; <Rating>: 1/16W; Status: Verified; Supplier 1: Digikey; Supplier Label: 5 kOhms ±1% 0.063W, 1/16W Chip Resistor 0402 (1005 Metric) Moisture Resistant Thick Film; Supplier Part Number 1: 13-RC0402FR-075KLCT-ND; Type: Standard
R215 = #1-061: Manufacturer 1: YAGEO; Manufacturer Part Number 1: RT0402DRD079K88L; AL-PN: #1-061; <Tolerance>: 0.005; Creator Project: DAP; Lead Time: 20 Weeks; PartType: Resistor; <Rating>: 1/16W; <Termination>: SMD; Status: Verified; Supplier 1: Digikey; Supplier Label: 9.88 kOhms ±0.5% 0.063W, 1/16W Chip Resistor 0402 (1005 Metric) Thin Film; Supplier Part Number 1: 311-2214-1-ND; Type: Standard
R217 = #1-065: Manufacturer 1: YAGEO; Manufacturer Part Number 1: RC0603FR-07270RL; AL-PN: #1-065; <Rating>: 0.1W; <Tolerance>: 0.01; <Termination>: SMD; Creator Project: DAP; Lead Time: 17 Weeks; PartType: Resistor; Status: Verified; Supplier 1: Digikey; Supplier Label: 270 Ohms ±1% 0.1W, 1/10W Chip Resistor 0603 (1608 Metric) Moisture Resistant Thick Film; Supplier Part Number 1: 311-270HRCT-ND; Type: Standard
R218 = #1-064: Manufacturer 1: YAGEO; Manufacturer Part Number 1: RT0603BRC07500RL; AL-PN: #1-064; <Rating>: 0.1W; <Tolerance>: 0.001; <Termination>: SMD; Creator Project: DAP; Lead Time: 20 Weeks; PartType: Resistor; Status: Verified; Supplier 1: Digikey; Supplier Label: 500 Ohms ±0.1% 0.1W, 1/10W Chip Resistor 0603 (1608 Metric) Thin Film; Supplier Part Number 1: 13-RT0603BRC07500RLCT-ND; Type: Standard
R219 = #1-087: Manufacturer 1: YAGEO; Manufacturer Part Number 1: RC0402FR-0788K7L; AL-PN: #1-087; <Tolerance>: 0.01; <Termination>: SMD; Creator Project: DAP; Lead Time: 17 Weeks; PartType: Resistor; <Rating>: 1/16W; Status: Verified; Supplier 1: Digikey; Supplier Label: 88.7 kOhms ±1% 0.063W, 1/16W Chip Resistor 0402 (1005 Metric) Moisture Resistant Thick Film; Supplier Part Number 1: 311-88.7KLRCT-ND; Type: Standard
R220 = #1-086: Manufacturer 1: YAGEO; Manufacturer Part Number 1: RT0603BRD07135KL; AL-PN: #1-086; <Tolerance>: 0.001; Creator Project: DAP; Lead Time: 20 Weeks; PartType: Resistor; <Rating>: 1/10W; <Termination>: SMD; Status: Verified; Supplier 1: Digikey; Supplier Label: 135 kOhms ±0.1% 0.1W, 1/10W Chip Resistor 0603 (1608 Metric) Thin Film; Supplier Part Number 1: 13-RT0603BRD07135KLCT-ND; Type: Standard
R222 R243 = #1-083: Manufacturer 1: YAGEO; Manufacturer Part Number 1: RC0402FR-07909KL; AL-PN: #1-083; <Tolerance>: 0.01; <Termination>: SMD; Creator Project: DAP; Lead Time: 17 Weeks; PartType: Resistor; <Rating>: 1/16W; Status: Verified; Supplier 1: Digikey; Supplier Label: 909 kOhms ±1% 0.063W, 1/16W Chip Resistor 0402 (1005 Metric) Moisture Resistant Thick Film; Supplier Part Number 1: YAG2377CT-ND; Type: Standard
R225 R244 = #1-084: Manufacturer 1: YAGEO; Manufacturer Part Number 1: RT0402BRD0790K9L; AL-PN: #1-084; <Tolerance>: 0.001; Creator Project: DAP; Lead Time: 20 Weeks; PartType: Resistor; <Rating>: 1/16W; <Termination>: SMD; Status: Verified; Supplier 1: Digikey; Supplier Label: 90.9 kOhms ±0.1% 0.063W, 1/16W Chip Resistor 0402 (1005 Metric) Thin Film; Supplier Part Number 1: YAG1489CT-ND; Type: Standard
R227 = #1-097: Manufacturer 1: YAGEO; Manufacturer Part Number 1: PE0805FRF7W0R5L; AL-PN: #1-097; <Tolerance>: 0.01; <Termination>: SMD; Creator Project: DAP; Lead Time: 20 Weeks; PartType: Resistor; <Rating>: 1/4W; Status: Verified; Supplier 1: Digikey; Supplier Label: 500 mOhms ±1% 0.25W, 1/4W Chip Resistor 0805 (2012 Metric) Automotive AEC-Q200, Current Sense Metal Film; Supplier Part Number 1: 13-PE0805FRF7W0R5LCT-ND; Type: Standard
R230 = #1-088: Manufacturer 1: YAGEO; Manufacturer Part Number 1: RT0402BRD0715K4L; AL-PN: #1-088; <Tolerance>: 0.01; Creator Project: DAP; Lead Time: 20 Weeks; PartType: Resistor; <Rating>: 1/16W; <Termination>: SMD; Status: Verified; Supplier 1: Digikey; Supplier Label: 15.4 kOhms ±0.1% 0.063W, 1/16W Chip Resistor 0402 (1005 Metric) Thin Film; Supplier Part Number 1: YAG4177CT-ND; Type: Standard
R232 R233 R248 = #1-085: Manufacturer 1: YAGEO; Manufacturer Part Number 1: RT0402BRD0733K2L; AL-PN: #1-085; <Tolerance>: 0.001; Creator Project: DAP; Lead Time: 20 Weeks; PartType: Resistor; <Rating>: 1/16W; <Termination>: SMD; Status: Verified; Supplier 1: Digikey; Supplier Label: 33.2 kOhms ±0.1% 0.063W, 1/16W Chip Resistor 0402 (1005 Metric) Thin Film; Supplier Part Number 1: YAG4244CT-ND; Type: Standard
R234 R235 = #1-024: Manufacturer 1: YAGEO; Manufacturer Part Number 1: RT0402BRE075K1L; AL-PN: #1-024; <Tolerance>: 0.001; Creator Project: aRTy; Lead Time: 20 Weeks; PartType: Resistor; <Rating>: 1/16W; <Termination>: SMD; Status: Verified; Supplier 1: Digikey; Supplier Label: 5.1 kOhms ±0.1% 0.063W, 1/16W Chip Resistor 0402 (1005 Metric) Thin Film; Supplier Part Number 1: YAG4404TR-ND; Type: Standard
R236 = #1-095: Manufacturer 1: YAGEO; Manufacturer Part Number 1: RT0603BRD07172KL; AL-PN: #1-095; <Tolerance>: 0.001; <Termination>: SMD; Creator Project: DAP; Lead Time: 20 Weeks; PartType: Resistor; <Rating>: 1/10W; Status: Verified; Supplier 1: Digikey; Supplier Label: 172 kOhms ±0.1% 0.1W, 1/10W Chip Resistor 0603 (1608 Metric) Thin Film; Supplier Part Number 1: 13-RT0603BRD07172KLCT-ND; Type: Standard
U200 U205 = #1-050: MF: Analog Devices; AL-PN: #1-050; SubType: Buck-Boost; <Termination>: SMD; Creator Project: DAP; Lead Time: 21 Weeks; SnapEDA_Link: https://www.snapeda.com/parts/LTC3440EMS%23TRPBF/Analog+Devices/view-part/?ref=snap; Package: MSOP-10 Linear Technology; Value: *; MP: LTC3440EMS#TRPBF; Check_prices: https://www.snapeda.com/parts/LTC3440EMS%23TRPBF/Analog+Devices/view-part/?ref=eda; PartType: IC; Status: Verified; Supplier 1: Digikey; Supplier Label: Buck-Boost Switching Regulator IC Positive Adjustable 2.5V 1 Output 600mA 10-TFSOP, 10-MSOP (0.118", 3.00mm Width); Supplier Part Number 1: LTC3440EMS#TRPBFCT-ND; Type: Standard; Manufacturer 1: Analog Devices; Manufacturer Part Number 1: LTC3440EMS#TRPBF
U201 = #1-089: Manufacturer_Name: Analog Devices Inc; Manufacturer_Part_Number: LT3093EDD#TRPBF; Manufacturer 1: Analog Devices; AL-PN: #1-089; SubType: Regulator; <Termination>: SMD; Creator Project: DAP; Lead Time: 10 Weeks; Type: Standard; Copyright: Copyright (C) 2026 Ultra Librarian. All rights reserved.; RefDes: RefDes; PartType: IC; Status: Verified; Supplier 1: Digikey; Supplier Label: Cuk Switching Regulator IC Negative Adjustable -1.265V 1 Output 250mA SOT-23-6 Thin, TSOT-23-6; Manufacturer Part Number 1: LT3462AES6#TRPBF
U202 = #1-054: MF: Texas Instruments; AL-PN: #1-054; SubType: Charger; <Termination>: SMD; Creator Project: DAP; Lead Time: 16 Weeks; SnapEDA_Link: https://www.snapeda.com/parts/BQ24250RGET/Texas+Instruments/view-part/?ref=snap; Package: VQFN-24 Texas Instruments; Value: *; MP: BQ24250RGET; Check_prices: https://www.snapeda.com/parts/BQ24250RGET/Texas+Instruments/view-part/?ref=eda; PartType: IC; Status: Verified; Supplier 1: Digikey; Supplier Label: Charger IC Lithium Ion 24-VQFN (4x4); Supplier Part Number 1: 296-36180-1-ND; Type: Standard; Manufacturer 1: Texas Instruments; Manufacturer Part Number 1: BQ24250RGET
U203 = #1-052: Manufacturer_Name: Analog Devices Inc; Manufacturer 1: Analog Devices; AL-PN: #1-052; SubType: LDO; <Termination>: SMD; Creator Project: DAP; Lead Time: 21 Weeks; Type: Standard; Copyright: Copyright (C) 2026 Ultra Librarian. All rights reserved.; Manufacturer_Part_Number: LT3093EDD#TRPBF; RefDes: RefDes; PartType: IC; Status: Verified; Supplier 1: Digikey; Supplier Label: Linear Voltage Regulator IC Negative Adjustable 1 Output 200mA 12-DFN (3x3); Supplier Part Number 1: 505-LT3093EDD#TRPBFCT-ND
U204 U206 = #1-051: MF: Analog Devices; AL-PN: #1-051; SubType: LDO; <Termination>: SMD; Creator Project: DAP; Lead Time: 21 Weeks; SnapEDA_Link: https://www.snapeda.com/parts/LT3042EDD%23PBF/Analog+Devices/view-part/?ref=snap; Package: DFN-10 Linear Technology; Value: *; MP: LT3042EDD#PBF; Check_prices: https://www.snapeda.com/parts/LT3042EDD%23PBF/Analog+Devices/view-part/?ref=eda; PartType: IC; Status: Verified; Supplier 1: Digikey; Supplier Label: Linear Voltage Regulator IC Positive Adjustable 1 Output 200mA 10-DFN (3x3); Supplier Part Number 1: 505-LT3042EDD#PBF-ND; Type: Standard; Manufacturer 1: Analog Devices; Manufacturer Part Number 1: LT3042EDD#PBF